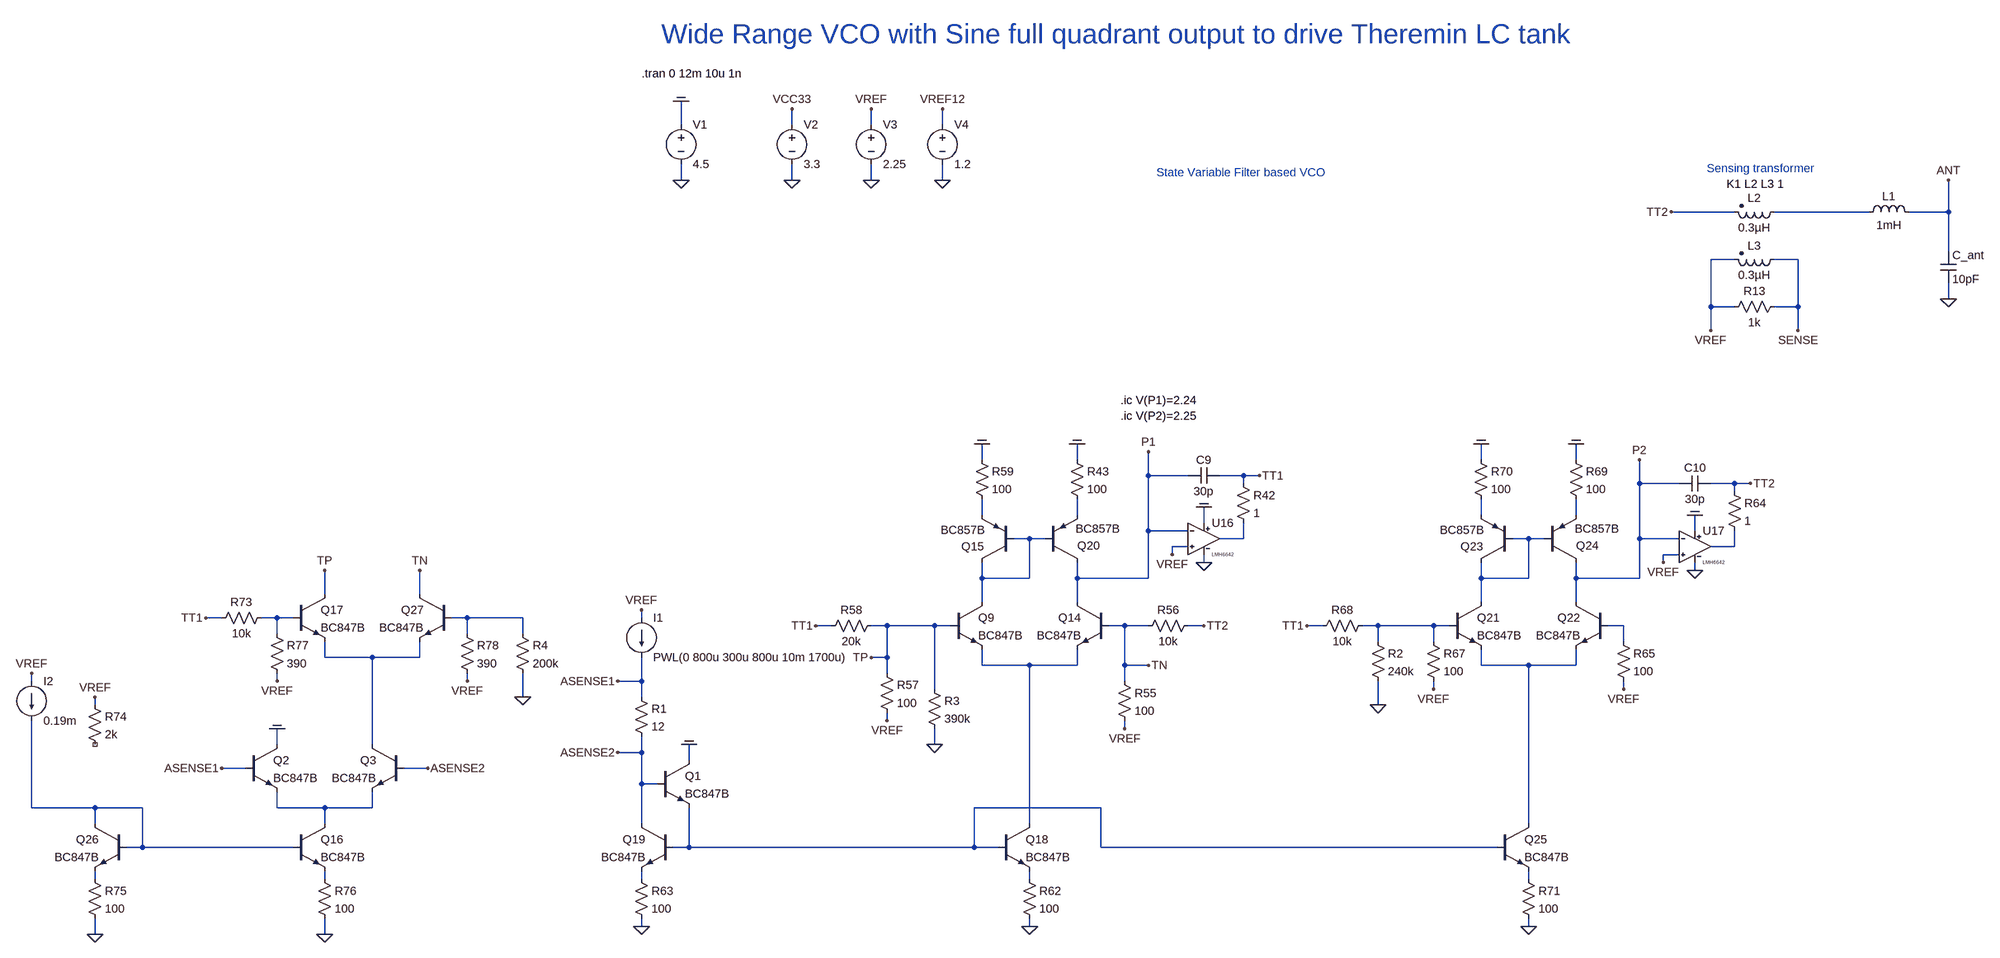
[diagram p0: schematic simple_bjt_pll_sensor_v01.asc]
simple_bjt_pll_sensor_v01.asc, the LTspice schematic file:
Version 4.1
SHEET 1 17540 12720
WIRE 4352 4176 4352 4128
WIRE 4576 4176 4576 4144
WIRE 4736 4176 4736 4144
WIRE 4880 4176 4880 4144
WIRE 4352 4288 4352 4256
WIRE 4576 4288 4576 4256
WIRE 4736 4288 4736 4256
WIRE 4880 4288 4880 4256
WIRE 6480 4352 6352 4352
WIRE 6752 4352 6560 4352
WIRE 6912 4352 6912 4288
WIRE 6912 4352 6832 4352
WIRE 6912 4432 6912 4352
WIRE 6480 4448 6432 4448
WIRE 6608 4448 6560 4448
WIRE 6912 4528 6912 4496
WIRE 6432 4544 6432 4448
WIRE 6480 4544 6432 4544
WIRE 6608 4544 6608 4448
WIRE 6608 4544 6560 4544
WIRE 6432 4592 6432 4544
WIRE 6608 4592 6608 4544
WIRE 4960 5280 4960 5248
WIRE 5152 5280 5152 5248
WIRE 5968 5280 5968 5248
WIRE 6160 5280 6160 5248
WIRE 5296 5312 5296 5264
WIRE 5376 5312 5296 5312
WIRE 5488 5312 5440 5312
WIRE 5520 5312 5488 5312
WIRE 5488 5328 5488 5312
WIRE 6288 5328 6288 5280
WIRE 6368 5328 6288 5328
WIRE 6480 5328 6432 5328
WIRE 6512 5328 6480 5328
WIRE 6480 5344 6480 5328
WIRE 4960 5392 4960 5360
WIRE 5152 5392 5152 5360
WIRE 5968 5392 5968 5360
WIRE 6160 5392 6160 5360
WIRE 5408 5408 5408 5376
WIRE 5296 5424 5296 5312
WIRE 5376 5424 5296 5424
WIRE 6400 5424 6400 5392
WIRE 5056 5440 5024 5440
WIRE 5088 5440 5056 5440
WIRE 5488 5440 5488 5408
WIRE 5488 5440 5440 5440
WIRE 6064 5440 6032 5440
WIRE 6096 5440 6064 5440
WIRE 6288 5440 6288 5328
WIRE 6368 5440 6288 5440
WIRE 5376 5456 5344 5456
WIRE 6480 5456 6480 5424
WIRE 6480 5456 6432 5456
WIRE 5344 5472 5344 5456
WIRE 6368 5472 6336 5472
WIRE 5408 5488 5408 5472
WIRE 6336 5488 6336 5472
WIRE 6400 5504 6400 5488
WIRE 4960 5520 4960 5488
WIRE 5056 5520 5056 5440
WIRE 5056 5520 4960 5520
WIRE 5152 5520 5152 5488
WIRE 5296 5520 5296 5424
WIRE 5296 5520 5152 5520
WIRE 5968 5520 5968 5488
WIRE 6064 5520 6064 5440
WIRE 6064 5520 5968 5520
WIRE 6160 5520 6160 5488
WIRE 6288 5520 6288 5440
WIRE 6288 5520 6160 5520
WIRE 3632 5552 3632 5504
WIRE 3824 5552 3824 5504
WIRE 4960 5568 4960 5520
WIRE 5152 5568 5152 5520
WIRE 5968 5568 5968 5520
WIRE 6160 5568 6160 5520
WIRE 3424 5600 3392 5600
WIRE 3536 5600 3504 5600
WIRE 3568 5600 3536 5600
WIRE 3920 5600 3888 5600
WIRE 4032 5600 3920 5600
WIRE 4272 5600 4272 5584
WIRE 4656 5616 4624 5616
WIRE 4768 5616 4736 5616
WIRE 4864 5616 4768 5616
WIRE 4896 5616 4864 5616
WIRE 5248 5616 5216 5616
WIRE 5296 5616 5248 5616
WIRE 5408 5616 5376 5616
WIRE 5648 5616 5616 5616
WIRE 5760 5616 5728 5616
WIRE 5872 5616 5760 5616
WIRE 5904 5616 5872 5616
WIRE 6256 5616 6224 5616
WIRE 3536 5632 3536 5600
WIRE 3920 5632 3920 5600
WIRE 4032 5632 4032 5600
WIRE 5760 5648 5760 5616
WIRE 5872 5648 5872 5616
WIRE 6256 5648 6256 5616
WIRE 3632 5680 3632 5648
WIRE 3728 5680 3632 5680
WIRE 3824 5680 3824 5648
WIRE 3824 5680 3728 5680
WIRE 4768 5680 4768 5616
WIRE 4768 5680 4736 5680
WIRE 4960 5696 4960 5664
WIRE 5056 5696 4960 5696
WIRE 5152 5696 5152 5664
WIRE 5152 5696 5056 5696
WIRE 5248 5696 5248 5616
WIRE 5296 5696 5248 5696
WIRE 5968 5696 5968 5664
WIRE 6064 5696 5968 5696
WIRE 6160 5696 6160 5664
WIRE 6160 5696 6064 5696
WIRE 4768 5712 4768 5680
WIRE 3040 5728 3040 5712
WIRE 3536 5728 3536 5712
WIRE 3920 5728 3920 5712
WIRE 4272 5728 4272 5680
WIRE 4272 5728 4224 5728
WIRE 5248 5728 5248 5696
WIRE 4864 5744 4864 5616
WIRE 5872 5744 5872 5728
WIRE 6256 5744 6256 5728
WIRE 4032 5760 4032 5712
WIRE 4272 5760 4272 5728
WIRE 3168 5776 3168 5760
WIRE 5760 5776 5760 5728
WIRE 4768 5808 4768 5792
WIRE 5248 5824 5248 5808
WIRE 3536 5856 3536 5824
WIRE 3728 5856 3728 5680
WIRE 4864 5856 4864 5824
WIRE 4272 5872 4272 5840
WIRE 4272 5872 4224 5872
WIRE 4368 5888 4368 5856
WIRE 3472 5904 3424 5904
WIRE 3840 5904 3792 5904
WIRE 4272 5936 4272 5872
WIRE 4304 5936 4272 5936
WIRE 3040 5984 3040 5808
WIRE 3168 5984 3040 5984
WIRE 3264 5984 3168 5984
WIRE 3536 5984 3536 5952
WIRE 3632 5984 3536 5984
WIRE 3728 5984 3728 5952
WIRE 3728 5984 3632 5984
WIRE 5200 5984 4944 5984
WIRE 3168 6016 3168 5984
WIRE 3632 6016 3632 5984
WIRE 4272 6016 4272 5936
WIRE 5056 6016 5056 5696
WIRE 6064 6016 6064 5696
WIRE 3264 6064 3264 5984
WIRE 3264 6064 3232 6064
WIRE 3568 6064 3264 6064
WIRE 4368 6064 4368 5984
WIRE 4368 6064 4336 6064
WIRE 4944 6064 4944 5984
WIRE 4944 6064 4368 6064
WIRE 4992 6064 4944 6064
WIRE 5200 6064 5200 5984
WIRE 6000 6064 5200 6064
WIRE 3168 6128 3168 6112
WIRE 3632 6128 3632 6112
WIRE 4272 6128 4272 6112
WIRE 5056 6128 5056 6112
WIRE 6064 6128 6064 6112
WIRE 4272 6224 4272 6208
WIRE 5056 6224 5056 6208
WIRE 6064 6224 6064 6208
WIRE 3168 6240 3168 6208
WIRE 3632 6240 3632 6208
FLAG 4352 4288 0
FLAG 4352 4128 COM
FLAG 4576 4288 0
FLAG 4576 4144 VCC33
FLAG 4736 4288 0
FLAG 4736 4144 VREF
FLAG 6912 4288 ANT
FLAG 6912 4528 0
FLAG 6352 4352 TT2
FLAG 6608 4592 SENSE
FLAG 6432 4592 VREF
FLAG 4880 4288 0
FLAG 4880 4144 VREF12
FLAG 5408 5488 0
FLAG 5408 5376 COM
FLAG 5344 5472 VREF
FLAG 5520 5312 TT1
FLAG 5248 5824 VREF
FLAG 5408 5616 TT2
FLAG 4768 5808 VREF
FLAG 4624 5616 TT1
FLAG 5056 6224 0
FLAG 4272 6224 0
FLAG 4960 5248 COM
FLAG 5152 5248 COM
FLAG 6400 5504 0
FLAG 6400 5392 COM
FLAG 6336 5488 VREF
FLAG 6512 5328 TT2
FLAG 6256 5744 VREF
FLAG 5872 5744 VREF
FLAG 5616 5616 TT1
FLAG 5968 5248 COM
FLAG 6160 5248 COM
FLAG 6064 6224 0
FLAG 3168 6240 0
FLAG 3168 5760 VREF
FLAG 3632 6240 0
FLAG 4736 5680 TP
FLAG 5296 5696 TN
FLAG 3632 5504 TP
FLAG 3824 5504 TN
FLAG 3392 5600 TT1
FLAG 3536 5728 VREF
FLAG 3920 5728 VREF
FLAG 4272 5584 VREF
FLAG 3040 5712 VREF
FLAG 5296 5264 P1
FLAG 6288 5280 P2
FLAG 5760 5776 0
FLAG 4864 5856 0
FLAG 4224 5728 ASENSE1
FLAG 4224 5872 ASENSE2
FLAG 4368 5856 COM
FLAG 3424 5904 ASENSE1
FLAG 3840 5904 ASENSE2
FLAG 3536 5824 COM
FLAG 4032 5760 0
SYMBOL voltage 4352 4160 R0
SYMATTR InstName V1
SYMATTR Value 4.5
SYMBOL voltage 4576 4160 R0
SYMATTR InstName V2
SYMATTR Value 3.3
SYMBOL voltage 4736 4160 R0
SYMATTR InstName V3
SYMATTR Value 2.25
SYMBOL ind 6736 4368 R270
WINDOW 0 32 56 VTop 2
WINDOW 3 5 56 VBottom 2
SYMATTR InstName L1
SYMATTR Value 1mH
SYMATTR SpiceLine Rser=60 Cpar=1pF
SYMBOL Cap 6896 4432 R0
SYMATTR InstName C_ant
SYMATTR Value 10pF
SYMBOL ind2 6576 4336 R90
WINDOW 0 4 56 VBottom 2
WINDOW 3 32 56 VTop 2
SYMATTR InstName L2
SYMATTR Value 0.3µH
SYMATTR SpiceLine Rser=0.01 Cpar=1p
SYMBOL ind2 6576 4432 R90
WINDOW 0 4 56 VBottom 2
WINDOW 3 32 56 VTop 2
SYMATTR InstName L3
SYMATTR Value 0.3µH
SYMATTR SpiceLine Rser=0.01 Cpar=1p
SYMBOL Res 6576 4528 R90
WINDOW 0 0 56 VBottom 2
WINDOW 3 32 56 VTop 2
SYMATTR InstName R13
SYMATTR Value 1k
SYMBOL voltage 4880 4160 R0
SYMATTR InstName V4
SYMATTR Value 1.2
SYMBOL Cap 5440 5296 R90
WINDOW 0 0 32 VBottom 2
WINDOW 3 32 32 VTop 2
SYMATTR InstName C9
SYMATTR Value 30p
SYMBOL LMH6642 5408 5376 R0
WINDOW 0 16 32 Left 2
SYMATTR InstName U16
SYMBOL Res 5472 5312 R0
SYMATTR InstName R42
SYMATTR Value 1
SYMBOL npn 4896 5568 R0
SYMATTR InstName Q9
SYMATTR Value BC847B
SYMBOL npn 5216 5568 M0
SYMATTR InstName Q14
SYMATTR Value BC847B
SYMBOL Res 5232 5712 R0
SYMATTR InstName R55
SYMATTR Value 100
SYMBOL Res 5392 5600 R90
WINDOW 0 0 56 VBottom 2
WINDOW 3 32 56 VTop 2
SYMATTR InstName R56
SYMATTR Value 10k
SYMBOL Res 4752 5696 R0
SYMATTR InstName R57
SYMATTR Value 100
SYMBOL Res 4752 5600 R90
WINDOW 0 0 56 VBottom 2
WINDOW 3 32 56 VTop 2
SYMATTR InstName R58
SYMATTR Value 20k
SYMBOL npn 4992 6016 R0
SYMATTR InstName Q18
SYMATTR Value BC847B
SYMBOL npn 4336 6016 M0
SYMATTR InstName Q19
SYMATTR Value BC847B
SYMBOL Res 5040 6112 R0
SYMATTR InstName R62
SYMATTR Value 100
SYMBOL Res 4256 6112 R0
SYMATTR InstName R63
SYMATTR Value 100
SYMBOL pnp 5024 5488 R180
WINDOW 0 60 32 Left 2
WINDOW 3 58 66 Left 2
SYMATTR InstName Q15
SYMATTR Value BC857B
SYMBOL pnp 5088 5488 M180
WINDOW 0 64 34 Left 2
WINDOW 3 61 68 Left 2
SYMATTR InstName Q20
SYMATTR Value BC857B
SYMBOL Res 5136 5264 R0
SYMATTR InstName R43
SYMATTR Value 100
SYMBOL Res 4944 5264 R0
SYMATTR InstName R59
SYMATTR Value 100
SYMBOL Cap 6432 5312 R90
WINDOW 0 0 32 VBottom 2
WINDOW 3 32 32 VTop 2
SYMATTR InstName C10
SYMATTR Value 30p
SYMBOL LMH6642 6400 5392 R0
WINDOW 0 16 32 Left 2
SYMATTR InstName U17
SYMBOL Res 6464 5328 R0
SYMATTR InstName R64
SYMATTR Value 1
SYMBOL npn 5904 5568 R0
SYMATTR InstName Q21
SYMATTR Value BC847B
SYMBOL npn 6224 5568 M0
SYMATTR InstName Q22
SYMATTR Value BC847B
SYMBOL Res 6240 5632 R0
SYMATTR InstName R65
SYMATTR Value 100
SYMBOL Res 5856 5632 R0
SYMATTR InstName R67
SYMATTR Value 100
SYMBOL Res 5744 5600 R90
WINDOW 0 0 56 VBottom 2
WINDOW 3 32 56 VTop 2
SYMATTR InstName R68
SYMATTR Value 10k
SYMBOL pnp 6032 5488 R180
WINDOW 0 60 32 Left 2
WINDOW 3 58 66 Left 2
SYMATTR InstName Q23
SYMATTR Value BC857B
SYMBOL pnp 6096 5488 M180
WINDOW 0 64 34 Left 2
WINDOW 3 61 68 Left 2
SYMATTR InstName Q24
SYMATTR Value BC857B
SYMBOL Res 6144 5264 R0
SYMATTR InstName R69
SYMATTR Value 100
SYMBOL Res 5952 5264 R0
SYMATTR InstName R70
SYMATTR Value 100
SYMBOL npn 6000 6016 R0
SYMATTR InstName Q25
SYMATTR Value BC847B
SYMBOL Res 6048 6112 R0
SYMATTR InstName R71
SYMATTR Value 100
SYMBOL npn 3232 6016 M0
SYMATTR InstName Q26
SYMATTR Value BC847B
SYMBOL Res 3152 5760 R0
SYMATTR InstName R74
SYMATTR Value 2k
SYMBOL Res 3152 6112 R0
SYMATTR InstName R75
SYMATTR Value 100
SYMBOL npn 3568 6016 R0
SYMATTR InstName Q16
SYMATTR Value BC847B
SYMBOL Res 3616 6112 R0
SYMATTR InstName R76
SYMATTR Value 100
SYMBOL npn 3568 5552 R0
SYMATTR InstName Q17
SYMATTR Value BC847B
SYMBOL npn 3888 5552 M0
SYMATTR InstName Q27
SYMATTR Value BC847B
SYMBOL Res 3520 5584 R90
WINDOW 0 0 56 VBottom 2
WINDOW 3 32 56 VTop 2
SYMATTR InstName R73
SYMATTR Value 10k
SYMBOL Res 3520 5616 R0
SYMATTR InstName R77
SYMATTR Value 390
SYMBOL Res 3904 5616 R0
SYMATTR InstName R78
SYMATTR Value 390
SYMBOL current 4272 5600 R0
WINDOW 123 0 0 Left 0
WINDOW 39 0 0 Left 0
SYMATTR InstName I1
SYMATTR Value PWL(0 800u 300u 800u 10m 1700u)
SYMBOL current 3040 5728 R0
WINDOW 123 0 0 Left 0
WINDOW 39 0 0 Left 0
SYMATTR InstName I2
SYMATTR Value 0.19m
SYMBOL Res 5744 5632 R0
SYMATTR InstName R2
SYMATTR Value 240k
SYMBOL Res 4848 5728 R0
SYMATTR InstName R3
SYMATTR Value 390k
SYMBOL Res 4256 5744 R0
SYMATTR InstName R1
SYMATTR Value 12
SYMBOL npn 4304 5888 R0
SYMATTR InstName Q1
SYMATTR Value BC847B
SYMBOL npn 3472 5856 R0
SYMATTR InstName Q2
SYMATTR Value BC847B
SYMBOL npn 3792 5856 M0
SYMATTR InstName Q3
SYMATTR Value BC847B
SYMBOL Res 4016 5616 R0
SYMATTR InstName R4
SYMATTR Value 200k
TEXT 4272 4072 Left 2 !.tran 0 12m 10u 1n
TEXT 4312 3992 Left 5 ;Wide Range VCO with Sine full quadrant output to drive Theremin LC tank
TEXT 6464 4296 Left 2 !K1 L2 L3 1
TEXT 6424 4264 Left 2 ;Sensing transformer
TEXT 5312 4272 Left 2 ;State Variable Filter based VCO
TEXT 5240 5160 Left 2 !.ic V(P1)=2.24\n.ic V(P2)=2.25

The netlist it stands for:
* simple_bjt_pll_sensor_v01.asc
V1 COM 0 4.5
V2 VCC33 0 3.3
V3 VREF 0 2.25
L1 N001 ANT 1mH Rser=60 Cpar=1pF
C_ant ANT 0 10pF
L2 N001 TT2 0.3µH Rser=0.01 Cpar=1p
L3 SENSE VREF 0.3µH Rser=0.01 Cpar=1p
R13 SENSE VREF 1k
V4 VREF12 0 1.2
C9 TT1 P1 30p
X§U16 P1 VREF COM 0 N007 LMH6642  ; pins In- In+ V+ V- OUT
R42 TT1 N007 1
Q9 N006 TP N015 0 BC847B
Q14 P1 TN N015 0 BC847B
R55 TN VREF 100
R56 TT2 TN 10k
R57 TP VREF 100
R58 TP TT1 20k
Q18 N015 N019 N023 0 BC847B
Q19 ASENSE2 N019 N022 0 BC847B
R62 N023 0 100
R63 N022 0 100
Q15 N006 N006 N002 0 BC857B
Q20 P1 N006 N003 0 BC857B
R43 COM N003 100
R59 COM N002 100
C10 TT2 P2 30p
X§U17 P2 VREF COM 0 N009 LMH6642  ; pins In- In+ V+ V- OUT
R64 TT2 N009 1
Q21 N008 N012 N016 0 BC847B
Q22 P2 N013 N016 0 BC847B
R65 N013 VREF 100
R67 N012 VREF 100
R68 N012 TT1 10k
Q23 N008 N008 N004 0 BC857B
Q24 P2 N008 N005 0 BC857B
R69 COM N005 100
R70 COM N004 100
Q25 N016 N019 N024 0 BC847B
R71 N024 0 100
Q26 N017 N017 N020 0 BC847B
R74 VREF NC_01 2k
R75 N020 0 100
Q16 N018 N017 N021 0 BC847B
R76 N021 0 100
Q17 TP N010 N014 0 BC847B
Q27 TN N011 N014 0 BC847B
R73 N010 TT1 10k
R77 N010 VREF 390
R78 N011 VREF 390
I1 VREF ASENSE1 PWL(0 800u 300u 800u 10m 1700u)
I2 VREF N017 0.19m
R2 N012 0 240k
R3 TP 0 390k
R1 ASENSE1 ASENSE2 12
Q1 COM ASENSE2 N019 0 BC847B
Q2 COM ASENSE1 N018 0 BC847B
Q3 N014 ASENSE2 N018 0 BC847B
R4 N011 0 200k
.model NPN NPN
.model PNP PNP
.lib standard.bjt
.tran 0 12m 10u 1n
* Wide Range VCO with Sine full quadrant output to drive Theremin LC tank
K1 L2 L3 1
* Sensing transformer
* State Variable Filter based VCO
.ic V(P1)=2.24
.ic V(P2)=2.25
.lib LMH6642.MOD
.backanno
.end